# Altium schematic sheet FK723MK1_ZGT6_DSUB_Driver.SchDoc: =SAP_Nr_Baugruppe
size A3; Organization: TRUMPF Laser Marking Systems AG; Address1: Trumpf Strasse 8; Address2: CH-7214 Grüsch; Revision: 00; SheetNumber: 1; SheetTotal: 1; Date: 19.03.2018; Author: 19.03.2018; SPICEModelCacheDGJBQTKQ: <root> / <DocumentId>DGJBQTKQ</DocumentId> / </root>; Time: 19.03.2018
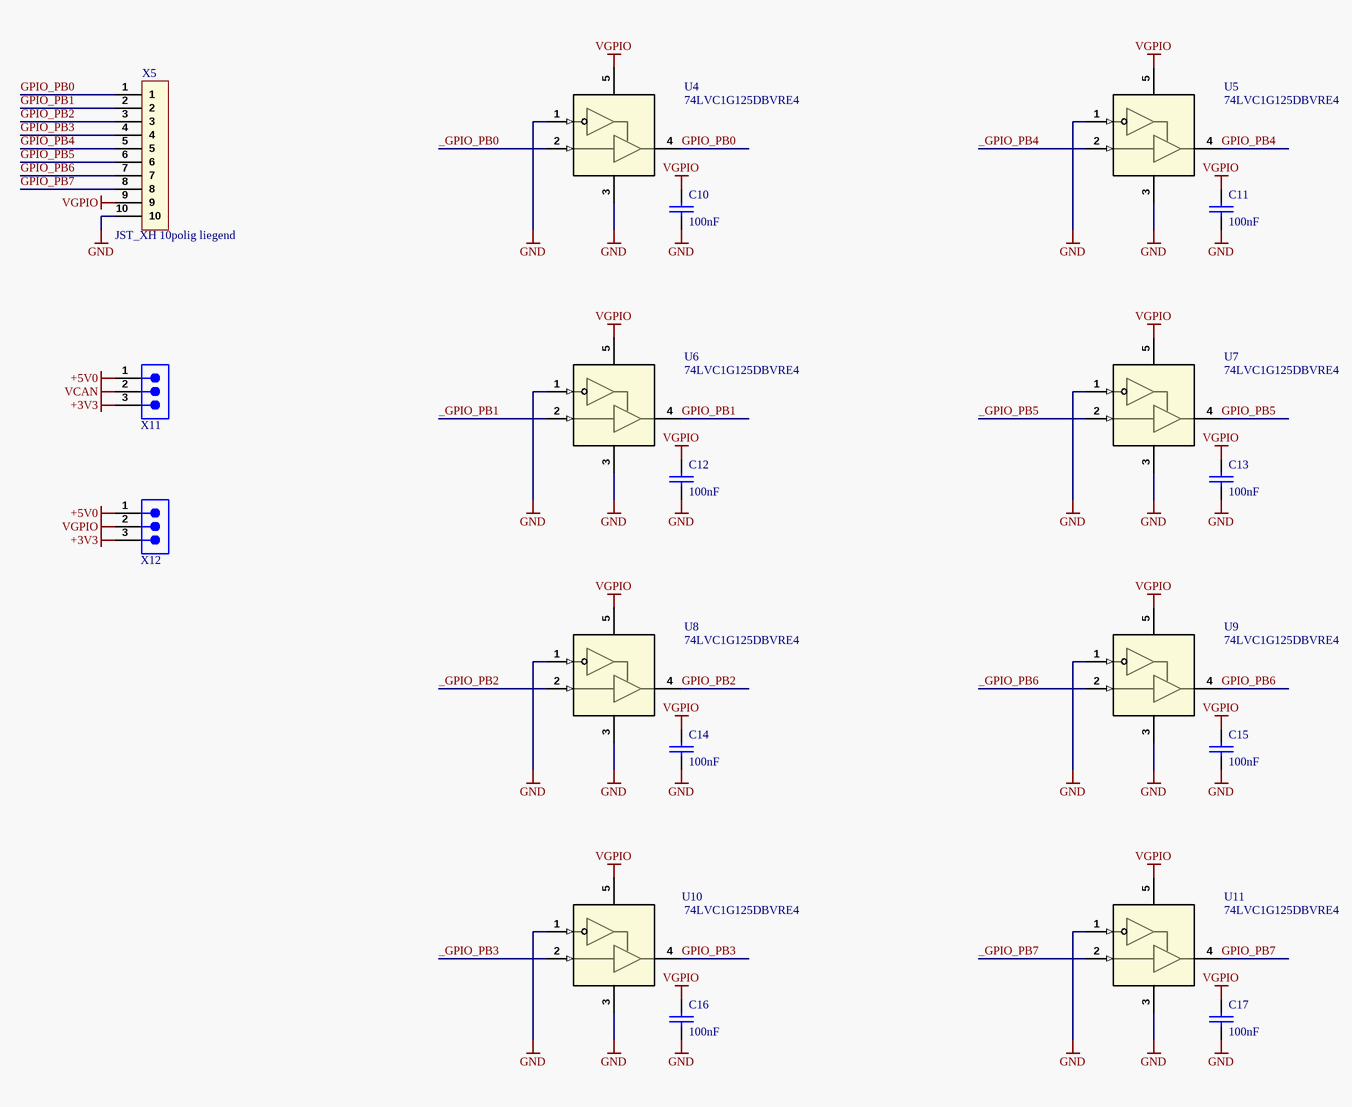
[diagram p0: FK723MK1_ZGT6_DSUB_Driver.SchDoc]

## Parts
C10  100nF  [0402]
C11  100nF  [0402]
C12  100nF  [0402]
C13  100nF  [0402]
C14  100nF  [0402]
C15  100nF  [0402]
C16  100nF  [0402]
C17  100nF  [0402]
U4  74LVC1G125DBVRE4  [DBV0005A_L]
U5  74LVC1G125DBVRE4  [DBV0005A_L]
U6  74LVC1G125DBVRE4  [DBV0005A_L]
U7  74LVC1G125DBVRE4  [DBV0005A_L]
U8  74LVC1G125DBVRE4  [DBV0005A_L]
U9  74LVC1G125DBVRE4  [DBV0005A_L]
U10  74LVC1G125DBVRE4  [DBV0005A_L]
U11  74LVC1G125DBVRE4  [DBV0005A_L]
X5  JST_XH 10polig liegend  [JST_XH 10polig, liegend]
X11  61300311121  [61300311121]  (value not drawn)
X12  61300311121  [61300311121]  (value not drawn)

## Nets
+3V3: X11.3 X12.3
+5V0: X11.1 X12.1
GND: C10.2 C11.2 C12.2 C13.2 C14.2 C15.2 C16.2 C17.2 U4.1(OE_N) U4.3(GND) U5.1(OE_N) U5.3(GND) U6.1(OE_N) U6.3(GND) U7.1(OE_N) U7.3(GND) U8.1(OE_N) U8.3(GND) U9.1(OE_N) U9.3(GND) U10.1(OE_N) U10.3(GND) U11.1(OE_N) U11.3(GND) X5.10
VCAN: X11.2
VGPIO: C10.1 C11.1 C12.1 C13.1 C14.1 C15.1 C16.1 C17.1 U4.5(VCC) U5.5(VCC) U6.5(VCC) U7.5(VCC) U8.5(VCC) U9.5(VCC) U10.5(VCC) U11.5(VCC) X5.9 X12.2
_GPIO_PB0: U4.2(A)
_GPIO_PB1: U6.2(A)
_GPIO_PB2: U8.2(A)
_GPIO_PB3: U10.2(A)
_GPIO_PB4: U5.2(A)
_GPIO_PB5: U7.2(A)
_GPIO_PB6: U9.2(A)
_GPIO_PB7: U11.2(A)
GPIO_PB0: U4.4(Y) X5.1
GPIO_PB1: U6.4(Y) X5.2
GPIO_PB2: U8.4(Y) X5.3
GPIO_PB3: U10.4(Y) X5.4
GPIO_PB4: U5.4(Y) X5.5
GPIO_PB5: U7.4(Y) X5.6
GPIO_PB6: U9.4(Y) X5.7
GPIO_PB7: U11.4(Y) X5.8

## Notes on the sheet
- BEAR.
- GEPR.
- DATUM
- NAME
- BENENNUNG
- MATERIAL-NR.
- GEN.
- FORMAT
- DOKUMENT-NR.
- BLATT-NR.
- von
- TRUMPF
  Laser Marking Systems AG
  Ausserfeld
  7214 Grüsch
  Schweiz
- A3
- Copyright by TRUMPF
- VERSION
- ÄNDERUNGSNR.

## Library data of the parts
C10-C17 = 100nF: 100nF 16V 10% 0402; Trumpf Nr.: 1606554
U4-U11 = 74LVC1G125DBVRE4: Single 1.65-V to 5.5-V buffer with 3-state outputs 5-SOT-23 -40 to 125; Manufacturer_Name: Texas Instruments; TYPE: TYPE; RefDes: RefDes; Copyright: Copyright (C) 2025 Ultra Librarian. All rights reserved.; Manufacturer_Part_Number: 74LVC1G125DBVRE4
X5 = JST_XH 10polig
X11 X12 = 61300311121: WR-PHD Pin Header, THT, Vertical, pitch 2.54mm, 1 Row, 3P; Manufacturer: Wurth Elektronik; Contact Resistance: 20mOhm; Rated Current: 3A; Working Voltage: 250V; Withstanding Voltage: 500V; Manufacturer Part Number: 61300311121; Category: Board-to-Board Connectors; Match Code: WR-PHD; ComponentLink1Description: Website Link; ComponentLink1URL: https://www.we-online.com/redexpert/article/61300311121?ad; ComponentLink2Description: Datasheet Link; ComponentLink2URL: https://www.we-online.com/redexpert/spec/61300311121?ad; Mount: Through Hole; Operating Temperature Max: 105°C; Operating Temperature Min: -40°C; Packaging: Bag; Gender: Pin Header; Number of Pins: 3; Number of Rows: 1; Orientation: Vertical; Pitch: 2.54mm